# EasyEDA schematic EEProm_writer_easyeda.json
TITLE: Sheet_1; REV: 1.0; Date: 2020-09-11; Sheet: 1/1; Drawn By: ovidijus.bickus; Company: Your Company
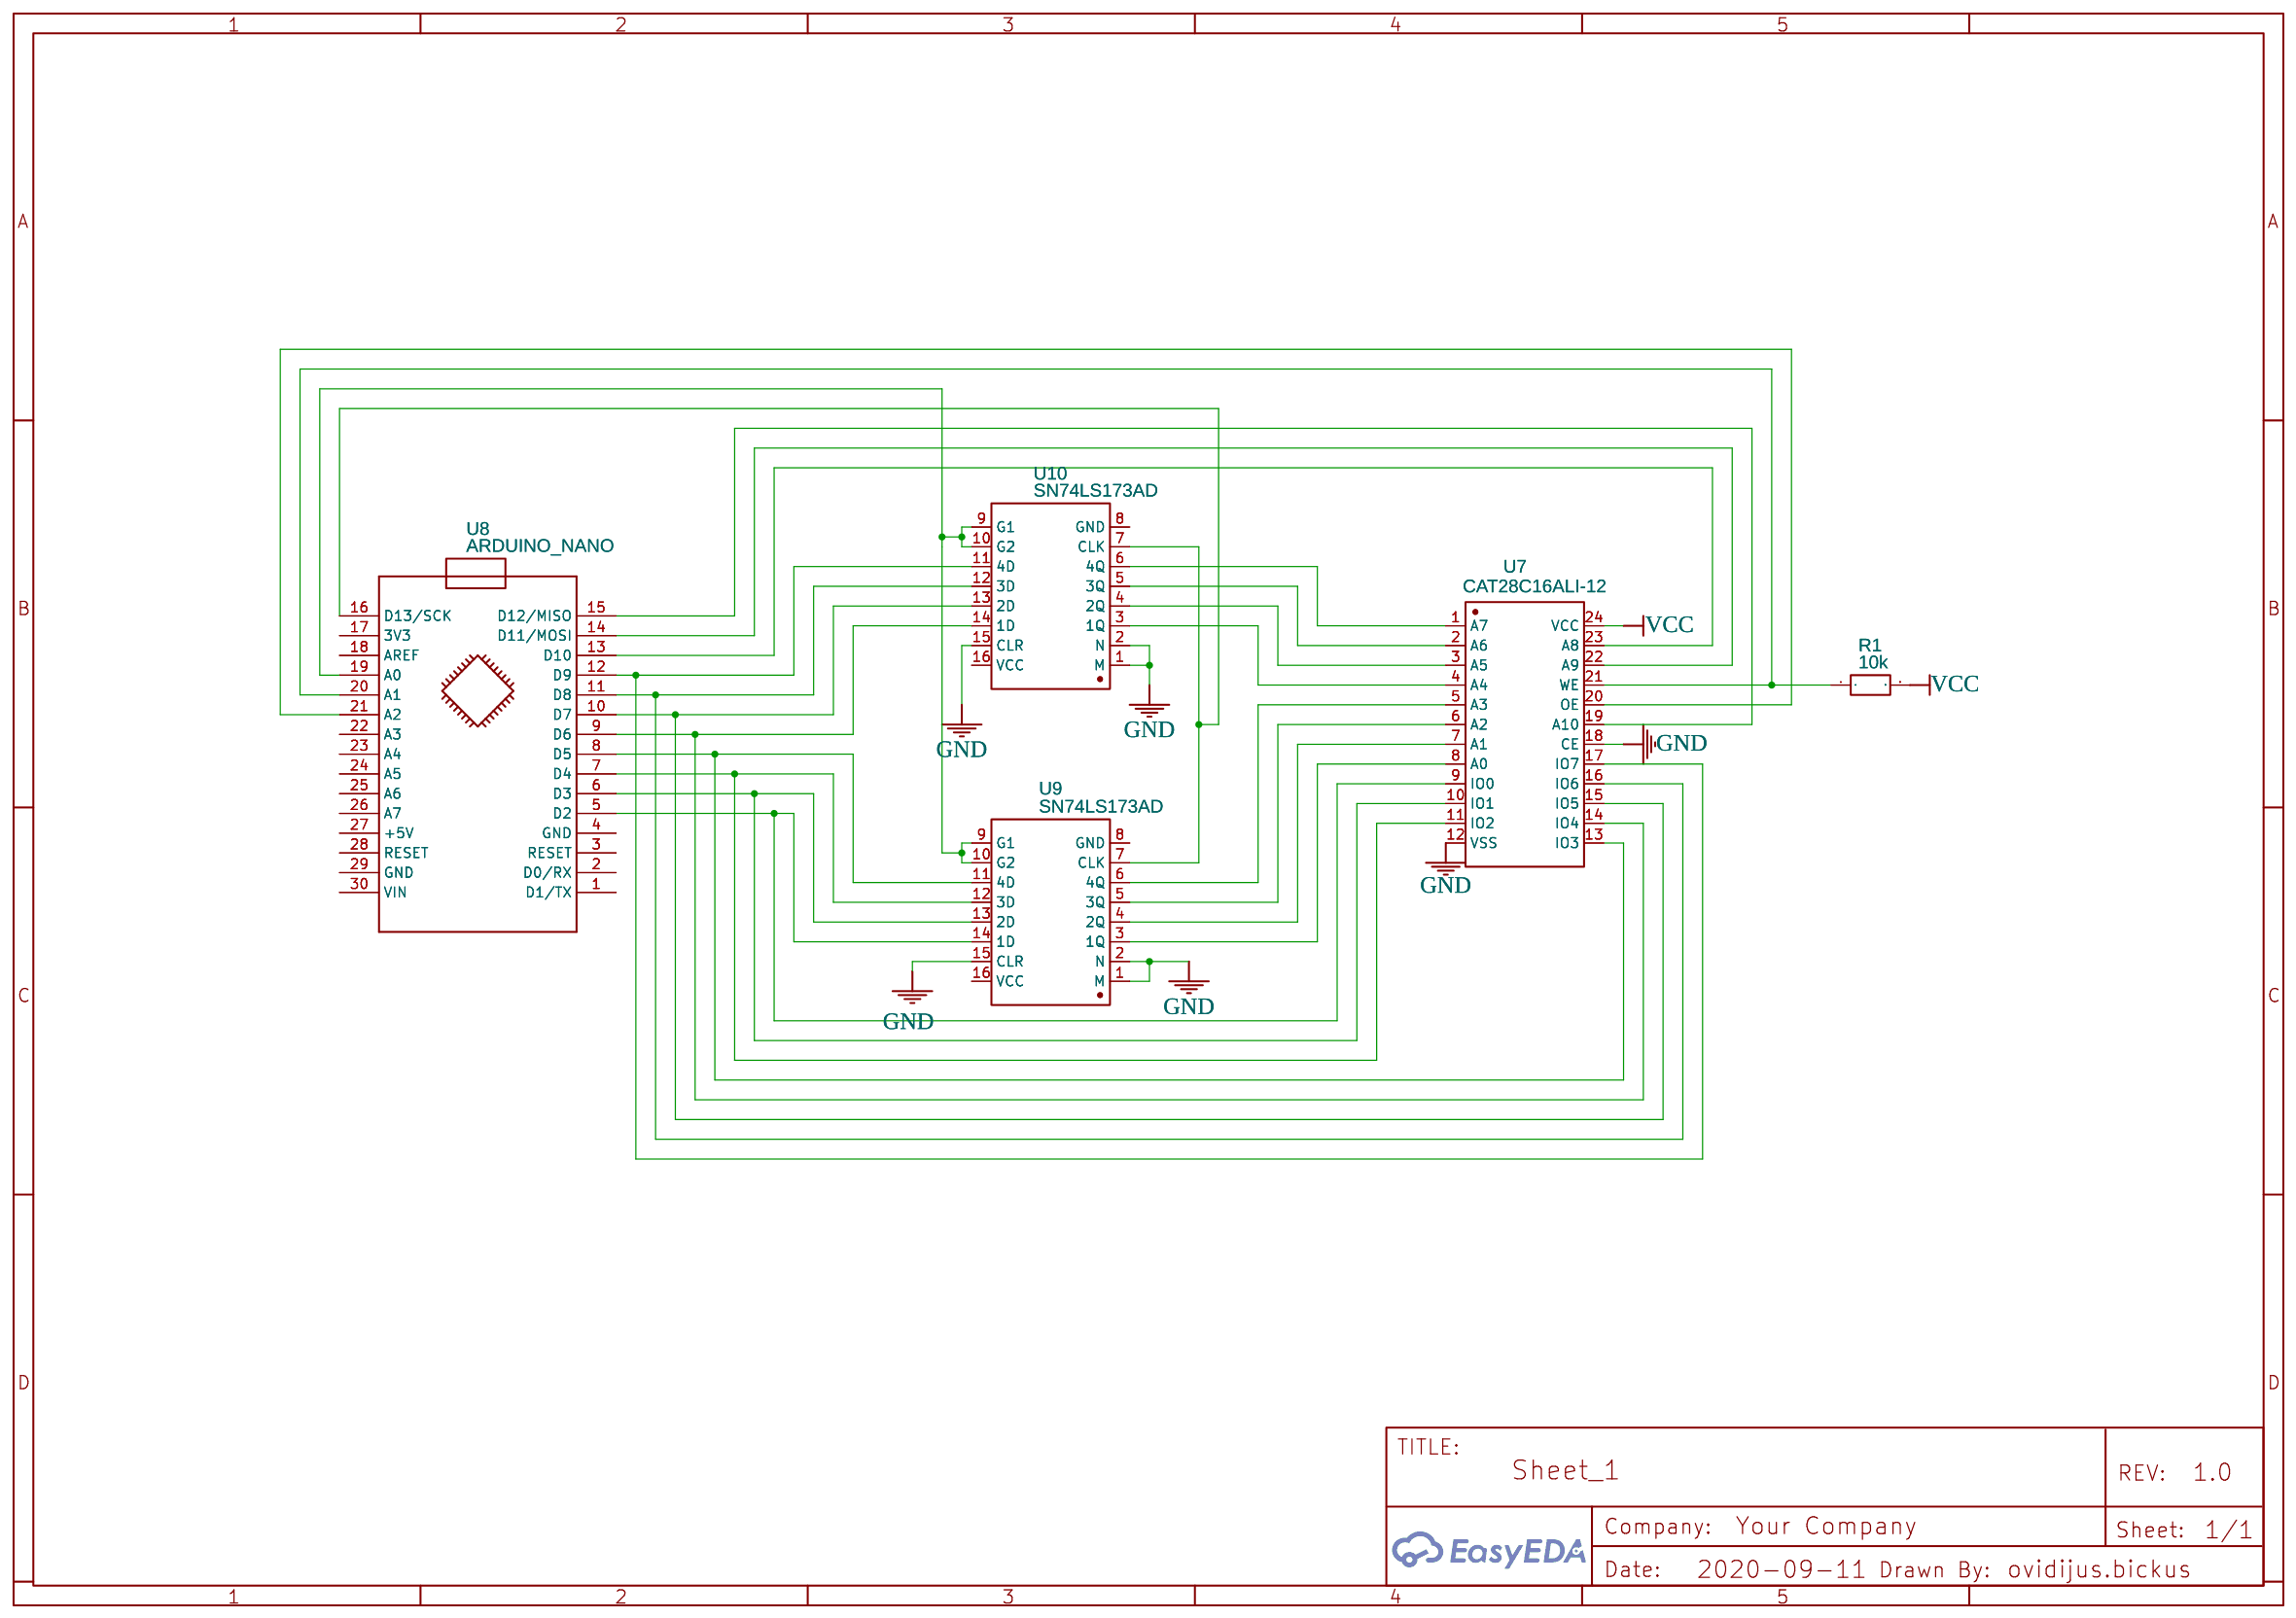
[diagram p0: schematic sheet]

## Parts
R1  10k  [R0603]
U7  CAT28C16ALI-12  [DIP24-600]
U8  ARDUINO_NANO  [ARDUINO_NANO]
U9  SN74LS173AD  [SOIC-16]
U10  SN74LS173AD  [SOIC-16]

## Library data of the parts
R1 = R_0603_EU: Contributor: LCEDA_Lib
U7 = CAT28C16ALI-12
U8 = ARDUINO_NANO: sourceId: KGSeAWhDB
U9 U10 = SN74LS173AD

## Nets
GND: U7.12(VSS) U7.18(CE) U9.1(M) U9.2(N) U9.15(CLR) U10.1(M) U10.2(N) U10.15(CLR)
VCC: R1.2 U7.24(VCC)
Net-(R1-1): R1.1 U7.21(WE) U8.20(A1)
Net-(U7-1): U7.1(A7) U10.6(4Q)
Net-(U7-2): U7.2(A6) U10.5(3Q)
Net-(U7-3): U7.3(A5) U10.4(2Q)
Net-(U7-4): U7.4(A4) U10.3(1Q)
Net-(U7-5): U7.5(A3) U9.6(4Q)
Net-(U7-6): U7.6(A2) U9.5(3Q)
Net-(U7-7): U7.7(A1) U9.4(2Q)
Net-(U7-8): U7.8(A0) U9.3(1Q)
Net-(U7-9): U7.9(IO0) U8.5(D2) U9.14(1D)
Net-(U7-10): U7.10(IO1) U8.6(D3) U9.13(2D)
Net-(U7-11): U7.11(IO2) U8.7(D4) U9.12(3D)
Net-(U7-13): U7.13(IO3) U8.8(D5) U9.11(4D)
Net-(U7-14): U7.14(IO4) U8.9(D6) U10.14(1D)
Net-(U7-15): U7.15(IO5) U8.10(D7) U10.13(2D)
Net-(U7-16): U7.16(IO6) U8.11(D8) U10.12(3D)
Net-(U7-17): U7.17(IO7) U8.12(D9) U10.11(4D)
Net-(U7-19): U7.19(A10) U8.15(D12/MISO)
Net-(U7-20): U7.20(OE) U8.21(A2)
Net-(U7-22): U7.22(A9) U8.14(D11/MOSI)
Net-(U7-23): U7.23(A8) U8.13(D10)
Net-(U8-16): U8.16(D13/SCK) U9.7(CLK) U10.7(CLK)
Net-(U8-19): U8.19(A0) U9.9(G1) U9.10(G2) U10.9(G1) U10.10(G2)

Not connected (* = marked no-connect by the designer): U8 1(D1/TX) 2(D0/RX) 3(RESET) 4(GND) 17(3V3) 18(AREF) 22(A3) 23(A4) 24(A5) 25(A6) 26(A7) 27(+5V) 28(RESET) 29(GND) 30(VIN); U9 8(GND) 16(VCC); U10 8(GND) 16(VCC)
